# Altium schematic sheet 安卓果园检测-数据节点.SchDoc
size A4
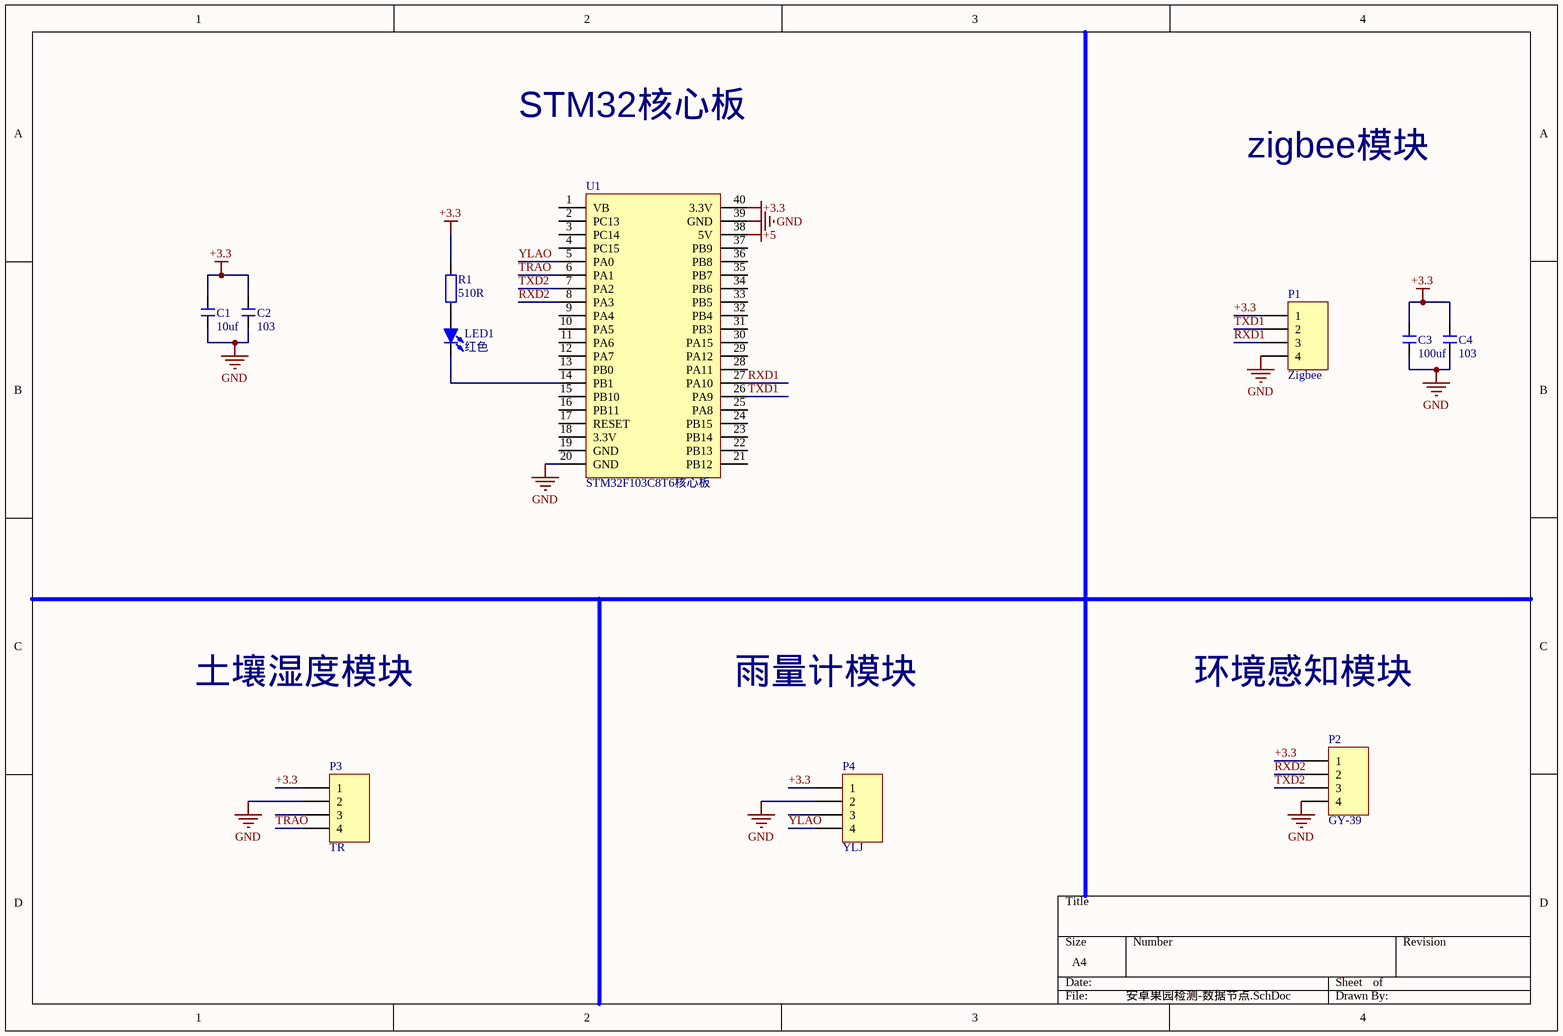
[diagram p0: 安卓果园检测-数据节点.SchDoc]

## Parts
C1  10uf  [R 0805_M]
C2  103  [R 0805_M]
C3  100uf  [R 0805_M]
C4  103  [R 0805_M]
LED1  红色  [LED 0805R]
P1  Zigbee  [HDR1X4]
P2  GY-39  [HDR1X4]
P3  TR  [HDR1X4]
P4  YLJ  [HDR1X4]
R1  510R  [R 0805_M]
U1  STM32F103C8T6核心板  [DIP40-600_MH]

## Nets
+3.3: C1.1 C2.1 C3.1 C4.1 P1.1 P2.1 P3.1 P4.1 R1.2 U1.40(3.3V)
+5: U1.38(5V)
GND: C1.2 C2.2 C3.2 C4.2 P1.4 P2.4 P3.2 P4.2 U1.20(GND) U1.39(GND)
RXD1: P1.3 U1.27(PA10)
RXD2: P2.2 U1.8(PA3)
TRAO: P3.4 U1.6(PA1)
TXD1: P1.2 U1.26(PA9)
TXD2: P2.3 U1.7(PA2)
YLAO: P4.4 U1.5(PA0)
NetLED1_1: LED1.1(A) R1.1
NetLED1_2: LED1.2(K) U1.14(PB1)

Not connected (* = marked no-connect by the designer): P3 3; P4 3; U1 1(VB) 2(PC13) 3(PC14) 4(PC15) 9(PA4) 10(PA5) 11(PA6) 12(PA7) 13(PB0) 15(PB10) 16(PB11) 17(RESET) 18(3.3V) 19(GND) 21(PB12) 22(PB13) 23(PB14) 24(PB15) 25(PA8) 28(PA11) 29(PA12) 30(PA15) 31(PB3) 32(PB4) 33(PB5) 34(PB6) 35(PB7) 36(PB8) 37(PB9)

## Notes on the sheet
- STM32核心板
- zigbee模块
- 土壤湿度模块
- 雨量计模块
- 环境感知模块

## Library data of the parts
C1-C4 = C-CC: 直插瓷片电容; 版权归属: 源创客; BOM名称: 直插瓷片电容; 学习资源: www.ooocke.com
LED1 = LED-SMD: 贴片LED; 版权归属: 源创客; BOM名称: 贴片LED; 学习资源: www.ooocke.com
P1-P4 = Header 4: Header, 4-Pin; LatestRevisionDate: 17-Jul-2002; LatestRevisionNote: Re-released for DXP Platform.; Publisher: Altium Limited
R1 = R-CRR: 直插色环电阻; BOM名称: 色环电阻; 版权归属: 源创客; 学习资源: www.ooocke.com